# EAGLE design LatarTouch (EAGLE 9.6.2)
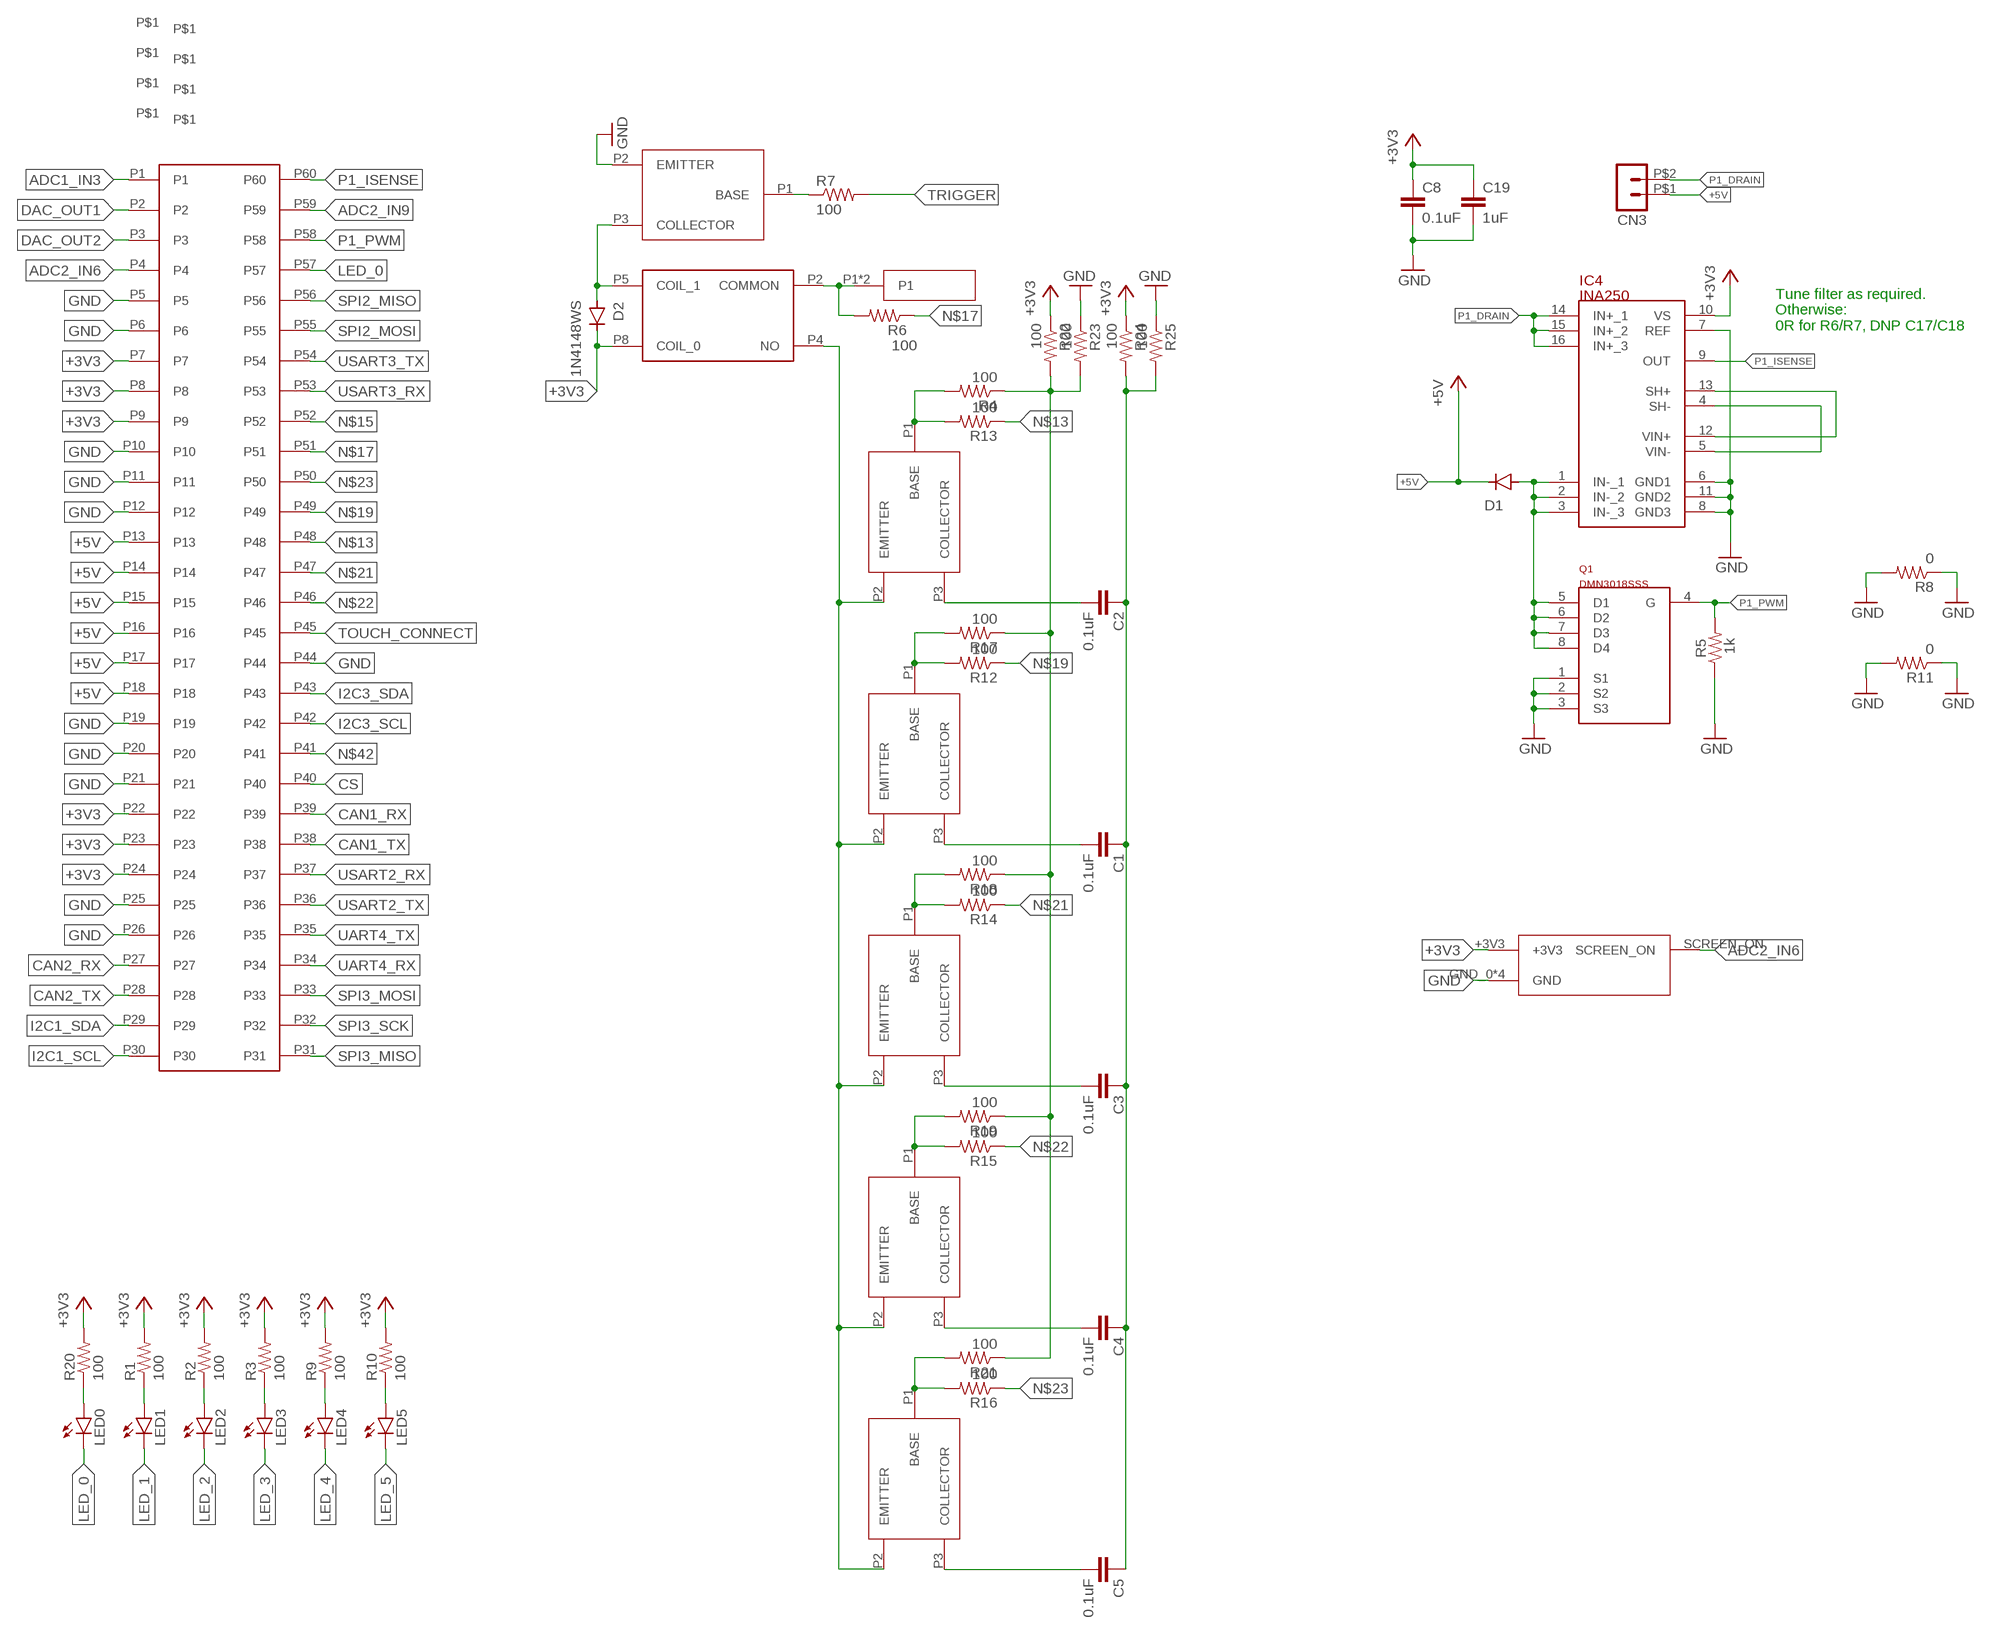
[diagram p0: schematic, sheet 1]

## Parts
C1  0.1uF  C-EUC0603  [C0603]
C2  0.1uF  C-EUC0603  [C0603]
C3  0.1uF  C-EUC0603  [C0603]
C4  0.1uF  C-EUC0603  [C0603]
C5  0.1uF  C-EUC0603  [C0603]
C8  0.1uF  C-EUC0805  [C0805]
C19  1uF  C-EUC0805  [C0805]
CN3  HEADER_POS2_43650-0212  [43650-0212]
D1  DIODE-DO214AC  [DO214AC]
D2  1N4148WS  [SOD-323]
IC4  INA250  [TSSOP16]
LED0  LEDCHIPLED_0603  [CHIPLED_0603]
LED1  LEDCHIPLED_0603  [CHIPLED_0603]
LED2  LEDCHIPLED_0603  [CHIPLED_0603]
LED3  LEDCHIPLED_0603  [CHIPLED_0603]
LED4  LEDCHIPLED_0603  [CHIPLED_0603]
LED5  LEDCHIPLED_0603  [CHIPLED_0603]
Q1  DMN3018SSS  [SO08]
R1  100  R-US_R0603  [R0603]
R2  100  R-US_R0603  [R0603]
R3  100  R-US_R0603  [R0603]
R4  100  R-US_R0603  [R0603]
R5  1k  RESISTOR0805  [0805]
R6  100  R-US_R0603  [R0603]
R7  100  R-US_R0603  [R0603]
R8  0  R-US_R0603  [R0603]
R9  100  R-US_R0603  [R0603]
R10  100  R-US_R0603  [R0603]
R11  0  R-US_R1206  [R1206]
R12  100  R-US_R0603  [R0603]
R13  100  R-US_R0603  [R0603]
R14  100  R-US_R0603  [R0603]
R15  100  R-US_R0603  [R0603]
R16  100  R-US_R0603  [R0603]
R17  100  R-US_R0603  [R0603]
R18  100  R-US_R0603  [R0603]
R19  100  R-US_R0603  [R0603]
R20  100  R-US_R0603  [R0603]
R21  100  R-US_R0603  [R0603]
R22  100  R-US_R0603  [R0603]
R23  100  R-US_R0603  [R0603]
R24  100  R-US_R0603  [R0603]
R25  100  R-US_R0603  [R0603]
U$4  TOUCH  TOUCH_PROBE  [TOUCH_PROBE]
U$5  MMBT3904  [SOT23]
U$6  DF12(3.0)-60DS-0.5V(86)  [DF12(3.0)-60DS-0.5V(86)]
U$7  9774030360R  [9774030360R]
U$8  DETECT_DAUGHTER_BOARD  [DETECT_DAUGHTER_BOARD]
U$9  9774030360R  [9774030360R]
U$10  9774030360R  [9774030360R]
U$11  9774030360R  [9774030360R]
U$14  G6L-1F  [G6L-1F]
U$15  MMBT3904  [SOT23]
U$16  MMBT3904  [SOT23]
U$17  MMBT3904  [SOT23]
U$18  MMBT3904  [SOT23]
U$19  MMBT3904  [SOT23]

## Nets
+3V3: C8.1 C19.1 IC4.10(VS) R1.2 R2.2 R3.2 R9.2 R10.2 R20.2 R22.1 R24.1 U$6.P7 U$6.P8 U$6.P9 U$6.P22 U$6.P23 U$6.P24 U$8.+3V3
+5V: CN3.P$1 D1.C U$6.P13 U$6.P14 U$6.P15 U$6.P16 U$6.P17 U$6.P18
ADC1_IN3: U$6.P1
ADC2_IN6: U$6.P4 U$8.SCREEN_ON
ADC2_IN9: U$6.P59
CAN1_RX: U$6.P39
CAN1_TX: U$6.P38
CAN2_RX: U$6.P27
CAN2_TX: U$6.P28
CS: U$6.P40
DAC_OUT1: U$6.P2
DAC_OUT2: U$6.P3
GND: C8.2 C19.2 IC4.6(GND1) IC4.7(REF) IC4.8(GND3) IC4.11(GND2) Q1.1(S1) Q1.2(S2) Q1.3(S3) R5.1 R8.1 R8.2 R11.1 R11.2 R23.1 R25.1 U$6.P5 U$6.P6 U$6.P10 U$6.P11 U$6.P12 U$6.P19 U$6.P20 U$6.P21 U$6.P25 U$6.P26 U$6.P44 U$8.GND_0(GND) U$8.GND_1(GND) U$8.GND_2(GND) U$8.GND_3(GND) U$15.P2(EMITTER)
I2C1_SCL: U$6.P30
I2C1_SDA: U$6.P29
I2C3_SCL: U$6.P42
I2C3_SDA: U$6.P43
LED_0: LED0.C U$6.P57
LED_1: LED1.C
LED_2: LED2.C
LED_3: LED3.C
LED_4: LED4.C
LED_5: LED5.C
N$1: R16.2 R21.2 U$19.P1(BASE)
N$2: LED1.A R1.1
N$3: R15.2 R19.2 U$18.P1(BASE)
N$4: R14.2 R18.2 U$17.P1(BASE)
N$5: R12.2 R17.2 U$16.P1(BASE)
N$6: R6.2 U$4.P1 U$4.P2(P1) U$14.P2(COMMON)
N$7: LED3.A R3.1
N$8: D1.A IC4.1(IN-_1) IC4.2(IN-_2) IC4.3(IN-_3) Q1.5(D1) Q1.6(D2) Q1.7(D3) Q1.8(D4)
N$9: IC4.4(SH-) IC4.5(VIN-)
N$10: R4.2 R13.2 U$5.P1(BASE)
N$11: IC4.12(VIN+) IC4.13(SH+)
N$12: LED2.A R2.1
N$13: R13.1 U$6.P48
N$14: U$5.P2(EMITTER) U$14.P4(NO) U$16.P2(EMITTER) U$17.P2(EMITTER) U$18.P2(EMITTER) U$19.P2(EMITTER)
N$15: U$6.P52
N$16: D2.A U$14.P5(COIL_1) U$15.P3(COLLECTOR)
N$17: R6.1 U$6.P51
N$18: D2.C U$14.P8(COIL_0)
N$19: R12.1 U$6.P49
N$21: R14.1 U$6.P47
N$22: R15.1 U$6.P46
N$23: R16.1 U$6.P50
N$24: R7.1 U$15.P1(BASE)
N$25: LED4.A R9.1
N$26: LED5.A R10.1
N$27: R4.1 R17.1 R18.1 R19.1 R21.1 R22.2 R23.2
N$34: C1.1 C2.1 C3.1 C4.1 C5.1 R24.2 R25.2
N$38: C5.2 U$19.P3(COLLECTOR)
N$39: C4.2 U$18.P3(COLLECTOR)
N$40: C3.2 U$17.P3(COLLECTOR)
N$41: C1.2 U$16.P3(COLLECTOR)
N$42: U$6.P41
N$43: C2.2 U$5.P3(COLLECTOR)
N$48: LED0.A R20.1
P1_DRAIN: CN3.P$2 IC4.14(IN+_1) IC4.15(IN+_2) IC4.16(IN+_3)
P1_ISENSE: IC4.9(OUT) U$6.P60
P1_PWM: Q1.4(G) R5.2 U$6.P58
SPI2_MISO: U$6.P56
SPI2_MOSI: U$6.P55
SPI3_MISO: U$6.P31
SPI3_MOSI: U$6.P33
SPI3_SCK: U$6.P32
TOUCH_CONNECT: U$6.P45
TRIGGER: R7.2
UART4_RX: U$6.P34
UART4_TX: U$6.P35
USART2_RX: U$6.P37
USART2_TX: U$6.P36
USART3_RX: U$6.P53
USART3_TX: U$6.P54
Unconnected: U$7.P$1 U$9.P$1 U$10.P$1 U$11.P$1

## Notes on the sheet
- Tune filter as required. 
  Otherwise:
  0R for R6/R7, DNP C17/C18

## Library data of the parts
C1-C5 C8 C19 = rcl:C-EU: CAPACITOR, European symbol; SPICEPREFIX: C
CN3 = con-molex-micro-fit-3_0:HEADER_POS2_?: Molex - Micro-Fit 3.0 Series connector, 3.00mm (0.118") pitch header, 2 positions.
D1 = diode:DIODE-: DIODE
D2 = Diodes:1N4148WS: DIODE GEN PURP 75V 150MA SOD323F Manufacturer's datasheet <https://www.onsemi.com/pub/Collateral/1N914BWS-D.pdf>; CREATED_BY: PCBLayout.com; DIGIKEY_PART_NUMBER: 1N4148WSFSTR-ND; MANUFACTURER: Diodes Incorporated; MPN: 1N4148WS; PACKAGE: SOD-323
IC4 = HappyMedium:INA250
LED0 LED1-LED5 = led:LED: LED OSRAM: - CHIPLED LG R971, LG N971, LY N971, LG Q971, LY Q971, LO R971, LY R971 LH N974, LH R974 LS Q976, LO Q976, LY Q976 LO Q996 - Hyper CHIPLED LW Q18S LB Q993, LB Q99A, LB R99A - SideLED LS A670, LO A670, LY A670, LG A670, LP A670 LB A673, LV A673, LT A673, LW A673 LH A674 LY A675 LS A676, LA A676, LO A676, LY A676, LW A676 LS A679, LY A679, LG A679 - Hyper Micro SIDELED® LS Y876, LA Y876, LO Y876, LY Y876 LT Y87S - SmartLED LW L88C, LW L88S LB L89C, LB L89S, LG L890 LS L89K, LO L89K, LY L89K LS L896, LA L896, LO L896, LY L896 - TOPLED LS T670, LO T670, LY T670, LG T670, LP T670 LSG T670, LSP T670, LSY T670, LOP T670, LYG T670 LG T671, LOG T671, LSG T671 LB T673, LV T673, LT T673, LW T673 LH T674 LS T676, LA T676, LO T676, LY T676, LB T676, LH T676, LSB T676, LW T676 LB T67C, LV T67C, LT T67C, LS T67K, LO T67K, LY T67K, LW E67C LS E67B, LA E67B, LO E67B, LY E67B, LB E67C, LV E67C, LT E67C LW T67C LS T679, LY T679, LG T679 LS T770, LO T770, LY T770, LG T770, LP T770 LB T773, LV T773, LT T773, LW T773 LH T774 LS E675, LA E675, LY E675, LS T675 LS T776, LA T776, LO T776, LY T776, LB T776 LHGB T686 LT T68C, LB T68C - Hyper Mini TOPLED® LB M676 - Mini TOPLED Santana® LG M470 LS M47K, LO M47K, LY M47K Source: http://www.osram.convergy.de LUXEON: - LUMILED® LXK2-PW12-R00, LXK2-PW12-S00, LXK2-PW14-U00, LXK2-PW14-V00 LXK2-PM12-R00, LXK2-PM12-S00, LXK2-PM14-U00 LXK2-PE12-Q00, LXK2-PE12-R00, LXK2-PE12-S00, LXK2-PE14-T00, LXK2-PE14-U00 LXK2-PB12-K00, LXK2-PB12-L00, LXK2-PB12-M00, LXK2-PB14-N00, LXK2-PB14-P00, LXK2-PB14-Q00 LXK2-PR12-L00, LXK2-PR12-M00, LXK2-PR14-Q00, LXK2-PR14-R00 LXK2-PD12-Q00, LXK2-PD12-R00, LXK2-PD12-S00 LXK2-PH12-R00, LXK2-PH12-S00 LXK2-PL12-P00, LXK2-PL12-Q00, LXK2-PL12-R00 Source: www.luxeon.com KINGBRIGHT: KA-3528ASYC Source: www.kingbright.com
Q1 = HappyMedium:DMN3018SSS
R1-R3 R6-R10 R20 = rcl:R-US_: RESISTOR, American symbol; SPICEPREFIX: R
R4 R11-R19 R21-R25 = resistor:R-US_: RESISTOR, American symbol
R5 = SparkFun-Resistors:RESISTOR: Generic Resistor Package
U$4 = psemi:TOUCH_PROBE
U$5 U$15-U$19 = psemi:MMBT3904
U$6 = poe:DF12(3.0)-60DS-0.5V(86)
U$7 U$9-U$11 = poe:9774030360R
U$8 = psemi:DETECT_DAUGHTER_BOARD
U$14 = psemi:G6L-1F

## Board
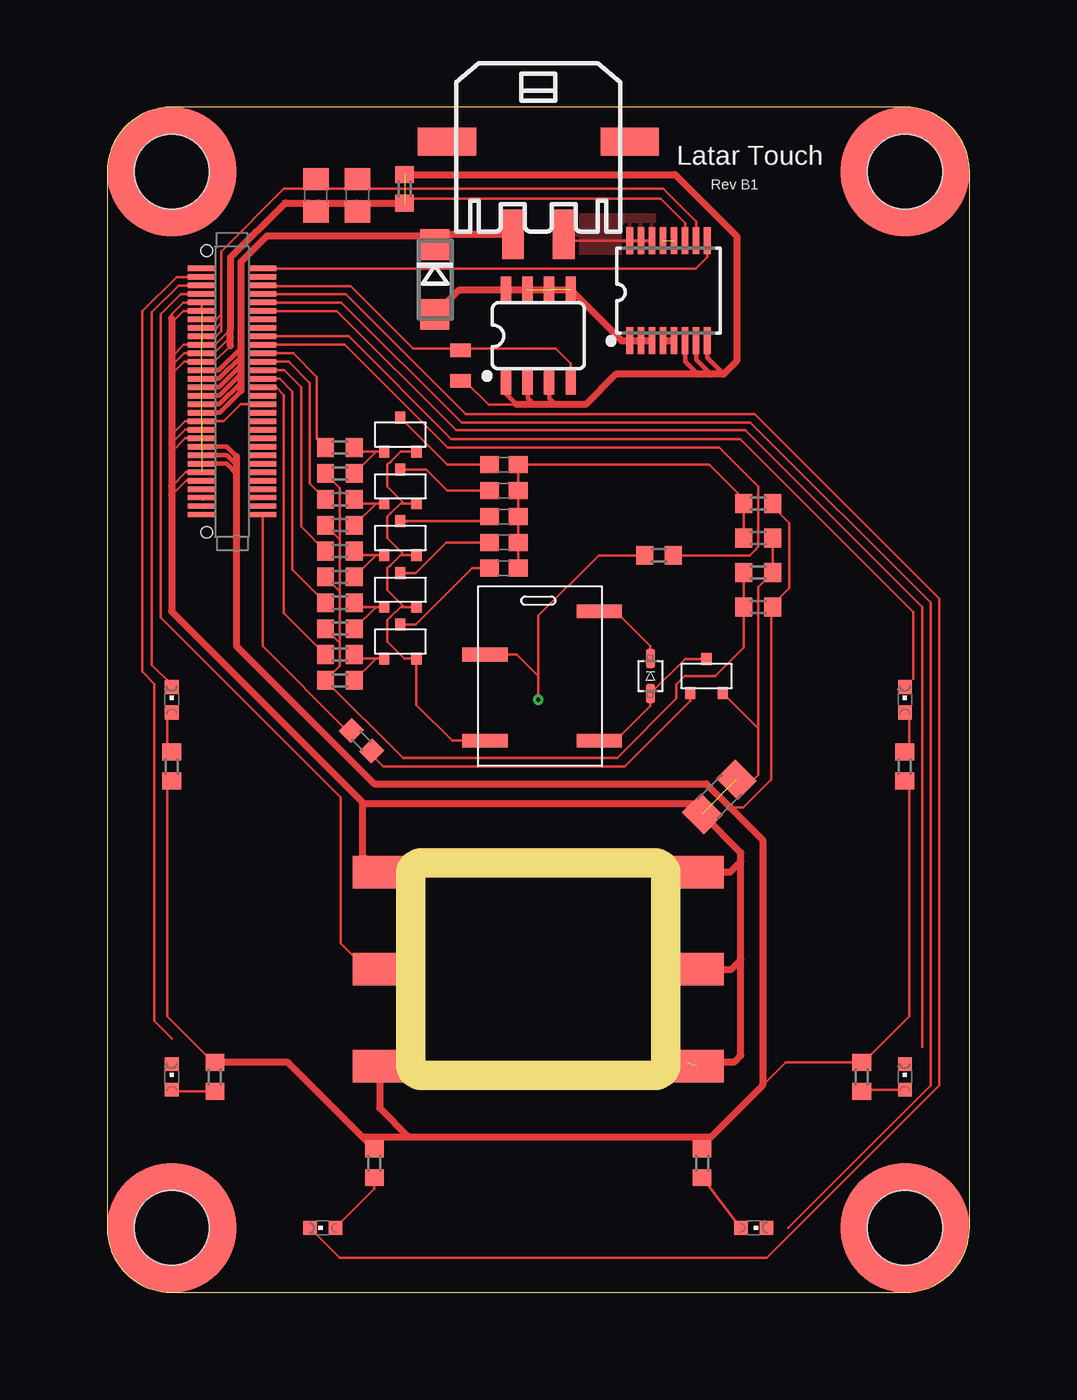
[diagram p1: board, top side]
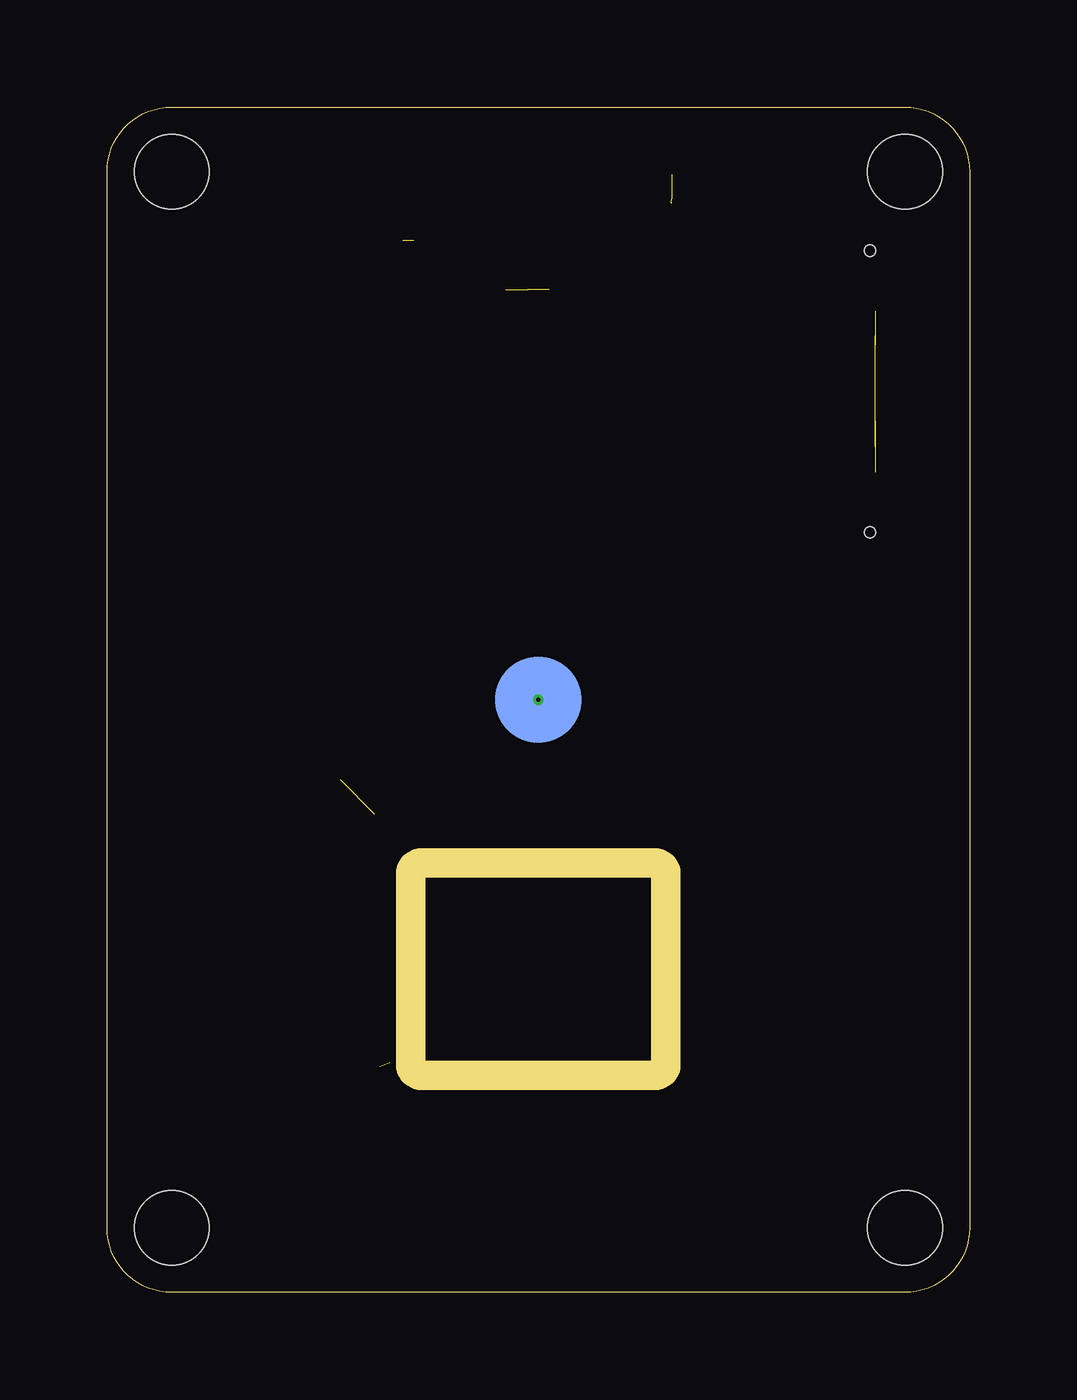
[diagram p2: board, bottom side, seen from below]

Size 50.8 x 69.85 mm. Coordinates in mm from the lower left corner, seen from the top.
Outline: 0,66.04 0,3.81 arc90 3.81,0 46.99,0 arc90 50.8,3.81 50.8,66.04 arc90 46.99,69.85 3.81,69.85 arc90 0,66.04
Copper layers (1*16): Top 0.0356mm / dielectric 1.5011mm / Bottom 0.0356mm
Design rules "LaenPCBOrder": minimum track width 6mil, minimum drill 13mil, track to track 6mil, track to pad 6mil, pad to pad 6mil, via to via 6mil, smd to smd 6mil, copper to edge 15mil, drill to drill 6mil, minimum pad ring 7mil, minimum via ring 7mil, stop-mask expansion 3mil, vias tented up to drill 0mil, thermal gap 10mil

### Footprints (pad centres in the part's own frame; a part is rotated, then mirrored left to right if it is on the bottom)
C0603 = smd 1.1 x 1: 1 -0.85,0; 2 0.85,0
C0805 = smd 1.3 x 1.5: 1 -0.95,0; 2 0.95,0
43650-0212 = smd 1.27 x 2.92: P$1 1.5,5.48; P$2 -1.5,5.48 | smd 3.43 x 1.65: TAB1 5.38,0; TAB2 -5.38,0
DO214AC = smd 1.8 x 1.7: A 2.05,0; C -2.05,0
SOD-323 = smd 1.14 x 0.52: A 1.04,0; C -1.04,0
TSSOP16 = smd 0.4 x 1.6: 1 -2.225,-2.85; 2 -1.575,-2.85; 3 -0.925,-2.85; 4 -0.275,-2.85; 5 0.375,-2.85; 6 1.025,-2.85; 7 1.675,-2.85; 8 2.325,-2.85; 9 2.325,3.05; 10 1.675,3.05; 11 1.025,3.05; 12 0.375,3.05; 13 -0.275,3.05; 14 -0.925,3.05; 15 -1.575,3.05; 16 -2.225,3.05
CHIPLED_0603 = smd 0.8 x 0.8: A 0,-0.75; C 0,0.75
SO08 = smd 0.6 x 1.55: 1 -1.905,-2.7; 2 -0.635,-2.7; 3 0.635,-2.7; 4 1.905,-2.7; 5 1.905,2.7; 6 0.635,2.7; 7 -0.635,2.7; 8 -1.905,2.7
R0603 = smd 1 x 1.1: 1 -0.85,0; 2 0.85,0
0805 = smd 0.8 x 1.2: 1 -0.9,0; 2 0.9,0
R1206 = smd 1.6 x 1.803: 1 -1.422,0; 2 1.422,0
TOUCH_PROBE = smd 5.08 x 5.08: P1 0,0 | drill 0.254: P2 0,0
SOT23 = smd 0.6 x 0.7: P1 -0.95,-1; P2 0.95,-1; P3 0,1
DF12(3.0)-60DS-0.5V(86) = smd 0.32 x 1.62: P1 7.25,1.8; P2 6.75,1.8; P3 6.25,1.8; P4 5.75,1.8; P5 5.25,1.8; P6 4.75,1.8; P7 4.25,1.8; P8 3.75,1.8; P9 3.25,1.8; P10 2.75,1.8; P11 2.25,1.8; P12 1.75,1.8; P13 1.25,1.8; P14 0.75,1.8; P15 0.25,1.8; P16 -0.25,1.8; P17 -0.75,1.8; P18 -1.25,1.8; P19 -1.75,1.8; P20 -2.25,1.8; P21 -2.75,1.8; P22 -3.25,1.8; P23 -3.75,1.8; P24 -4.25,1.8; P25 -4.75,1.8; P26 -5.25,1.8; P27 -5.75,1.8; P28 -6.25,1.8; P29 -6.75,1.8; P30 -7.25,1.8; P31 -7.25,-1.8; P32 -6.75,-1.8; P33 -6.25,-1.8; P34 -5.75,-1.8; P35 -5.25,-1.8; P36 -4.75,-1.8; P37 -4.25,-1.8; P38 -3.75,-1.8; P39 -3.25,-1.8; P40 -2.75,-1.8; P41 -2.25,-1.8; P42 -1.75,-1.8; P43 -1.25,-1.8; P44 -0.75,-1.8; P45 -0.25,-1.8; P46 0.25,-1.8; P47 0.75,-1.8; P48 1.25,-1.8; P49 1.75,-1.8; P50 2.25,-1.8; P51 2.75,-1.8; P52 3.25,-1.8; P53 3.75,-1.8; P54 4.25,-1.8; P55 4.75,-1.8; P56 5.25,-1.8; P57 5.75,-1.8; P58 6.25,-1.8; P59 6.75,-1.8; P60 7.25,-1.8 | hole 0.65: -8.3,1.5; 8.3,1.5
9774030360R = smd 7.62 x 7.62: P$1 0,0 | hole 4.4: 0,0
DETECT_DAUGHTER_BOARD = smd 3.175 x 1.905: +3V3 -9.347,-5.715; GND_0 -9.347,5.715; GND_1 9.347,-5.715; GND_2 9.347,0; GND_3 9.347,5.715; SCREEN_ON -9.347,0
G6L-1F = smd 0.8 x 2.66: P2 -1.27,-3.14; P4 3.81,-3.14; P5 3.81,3.6; P8 -3.81,3.6

### Placement (x,y rotation side)
C1  23.37,47.24 180 top
C2  23.37,45.72 180 top
C3  23.37,44.2 180 top
C4  23.37,42.67 180 top
C5  23.37,48.77 180 top
C8  12.29,64.64 270 top
C19  14.76,64.64 270 top
CN3  25.4,67.82 180 top
D1  19.3,59.69 270 top
D2  32,36.32 270 top
IC4  33.02,58.93 0 top
LED0  12.7,3.81 90 top
LED1  38.1,3.81 270 top
LED2  3.81,34.92 0 top
LED3  46.99,34.92 0 top
LED4  3.81,12.7 0 top
LED5  46.99,12.7 0 top
Q1  25.4,56.39 0 top
R1  35.05,7.62 90 top
R2  3.81,30.99 270 top
R3  46.99,30.99 270 top
R4  13.72,42.16 0 top
R5  20.83,54.61 90 top
R6  32.51,43.43 180 top
R7  14.99,32.51 135 top
R8  17.53,65.02 90 top
R9  6.35,12.7 90 top
R10  44.45,12.7 90 top
R11  36.07,29.21 45 top
R12  13.72,46.74 0 top
R13  13.72,43.69 0 top
R14  13.72,40.64 0 top
R15  13.72,37.59 0 top
R16  13.72,49.78 0 top
R17  13.72,45.21 0 top
R18  13.72,39.12 0 top
R19  13.72,36.07 0 top
R20  15.75,7.62 90 top
R21  13.72,48.26 0 top
R22  38.35,40.39 180 top
R23  38.35,42.42 180 top
R24  38.35,46.48 180 top
R25  38.35,44.45 180 top
U$4  25.4,34.92 0 bottom
U$5  17.27,44.45 0 top
U$6  7.37,53.09 90 top
U$7  3.81,66.04 0 top
U$8  25.4,19.05 0 top
U$9  3.81,3.81 0 top
U$10  46.99,3.81 0 top
U$11  46.99,66.04 0 top
U$14  25.4,36.32 270 top
U$15  35.31,36.32 0 top
U$16  17.27,47.5 0 top
U$17  17.27,41.4 0 top
U$18  17.27,38.35 0 top
U$19  17.27,50.55 0 top

### Tracks (layer width: path | path; a pad name or v marks a point on that pad's centre or on a via)
+3V3  (1 unrouted)
  Top 0.152: IC4.10 34.7,63.09 32.77,65.02 14.95,65.02 | U$6.P8 5.59,56.84 | 5.59,56.84 6.42,56.84 6.73,57.15 | 6.73,57.63 6.73,61.34 10.41,65.02 11.72,65.02 | 11.72,65.02 14.95,65.02 | 5.57,56.81 5.59,56.84 | R2.2 3.56,29.88 3.56,16.26 6.31,13.51 10.71,13.51 | U$6.P9 6.43,56.34 6.73,56.64 6.73,57.15 | 6.73,57.15 6.73,57.63 | U$6.P7 6.43,57.34 6.73,57.63 | C8.1 11.72,65.02 | 14.95,65.02 14.76,65.22 C19.1 | 20.07,9.14 18.8,9.14 | 38.1,11.68 39.97,13.55 R10.2 44.54,13.55 47.24,16.26 47.24,29.88 R3.2 | 36.7,28.57 37.47,28.57 39.12,30.23 39.12,40.3 R22.1 39.2,40.54 40.19,41.52 40.19,45.35 39.2,46.33 R24.1 | R1.2 35.05,9.14
  Top 0.254: U$6.P22 7.06,49.84 7.62,49.28 | U$6.P23 7.05,49.34 7.62,48.77 | U$6.P24 7.04,48.84 7.62,48.26
  Top 0.406: 7.62,49.28 7.62,48.77 7.62,48.26 7.62,38.1 15.75,29.97 35.31,29.97 36.7,28.57 38.61,26.67 38.61,12.19 38.1,11.68 35.56,9.14 35.05,9.14 18.8,9.14 17.78,9.14 | R20.2 15.07,9.14 | 15.07,9.14 10.71,13.51 10.67,13.55 R9.2 | U$8.+3V3 16.05,10.87 17.78,9.14 | 17.78,9.14 15.07,9.14
+5V
  Top 0.254: U$6.P18 6.62,51.84 7.9,53.11 | U$6.P17 6.62,52.34 7.9,53.62 | U$6.P16 6.61,52.84 7.9,54.13 | U$6.P15 6.6,53.34 7.9,54.63 | U$6.P14 6.59,53.84 7.9,55.14 | U$6.P13 6.58,54.34 7.9,55.65
  Top 0.406: 7.9,53.11 7.9,53.62 7.9,54.13 7.9,54.63 7.9,55.14 7.9,55.65 7.9,60.73 9.42,62.25 18.8,62.25 D1.C 19.9,62.34 CN3.P$1 23.82,62.41
ADC1_IN3
  Top 0.152: U$6.P1 5.56,60.33
ADC2_IN6
  Top 0.152: U$6.P4 4.35,58.84 3.17,57.66 3.17,39.76 13.77,29.16 13.77,20.57 15.29,19.05 U$8.SCREEN_ON
CAN2_RX
  Top 0.152: U$6.P27 5.68,47.23
CAN2_TX
  Top 0.152: U$6.P28 5.68,46.73
DAC_OUT1
  Top 0.152: U$6.P2 4.11,59.84 2.08,57.81 2.08,36.58 2.79,35.87 2.79,16 3.81,14.99
DAC_OUT2
  Top 0.152: U$6.P3 4.22,59.34 2.64,57.76 2.64,36.98 3.81,35.81
GND  (10 unrouted)
  Top 0.152: 7.26,56.74 6.36,55.84 U$6.P10 4.53,55.84 3.81,55.12 3.81,54.61 | 10.49,64.19 10.53,64.19 | 17.54,64.44 32.61,64.44 34.05,63.01 IC4.11 | 23.47,53.71 Q1.1 | 3.81,50.55 4.6,51.34 U$6.P19 6.89,51.34 7.89,52.34 U$6.P44 | U$6.P20 4.61,50.84 3.81,50.04 | U$6.P21 4.62,50.34 3.81,49.53 | U$6.P25 4.65,48.34 3.81,47.5 | U$6.P26 4.66,47.84 3.81,46.99 | 3.81,54.61 3.81,54.1 4.54,54.84 U$6.P12 6.33,54.84 7.26,55.77 | 3.81,54.61 4.54,55.34 U$6.P11 6.31,55.34 7.26,56.29 | 11.8,64.19 C8.2 12.29,64.03 12.45,64.19 | 24.13,52.32 22.47,52.32 21.08,53.71 R5.1 | R11.2 38.09,30.22 38.35,30.48 38.35,33.22 | R11.1 34.47,28.79 34.45,28.79 | U$15.P2 38.35,33.22 | 38.35,33.22 38.35,41.57 R23.1 R25.1 | C19.2 14.76,64.16 14.73,64.19 | U$6.P5 U$6.P6 4.5,57.84 3.81,57.15 3.81,57.4 3.81,57.66 4.49,58.34 U$6.P5
  Top 0.254: 34.04,56.07 IC4.6 34.05,54.85 34.8,54.1 | Q1.1 23.37,53.56 23.37,53.09 24.13,52.32 25.15,52.32 | 28.19,52.32 26.42,52.32 | 26.42,52.32 25.15,52.32 | Q1.2 24.77,52.7 25.15,52.32 | Q1.3 26.04,52.7 26.42,52.32 | IC4.7 34.7,54.97 35.56,54.1 | IC4.8 35.34,55.08 36.32,54.1
  Top 0.406: 10.53,64.19 11.8,64.19 12.45,64.19 14.73,64.19 17.57,64.19 | 10.49,64.19 7.26,60.96 7.26,56.74 7.26,56.29 7.26,55.77 | U$8.GND_0 15.04,25.78 15.04,28.79 15.15,28.79 | 34.45,28.79 15.15,28.79 | U$8.GND_3 36.7,24.77 37.34,25.4 | 37.34,19.61 37.34,13.97 36.93,13.56 34.16,13.56 | U$8.GND_2 36.78,19.05 37.34,19.61 | 37.34,19.61 37.34,25.4 | 37.34,25.4 37.34,25.91 R11.1 | 15.15,28.79 3.81,40.13 3.81,46.99 3.81,47.5 3.81,57.4 | 24.13,52.32 28.19,52.32 29.97,54.1 34.8,54.1 35.56,54.1 36.32,54.1 37.08,54.86 37.08,62.25 33.46,65.87 R8.2
I2C1_SCL
  Top 0.152: U$6.P30 6.23,45.84
I2C1_SDA
  Top 0.152: U$6.P29 5.68,46.23
LED_0
  Top 0.152: U$6.P57 14.06,58.84 21.13,51.77 38.15,51.77 49.02,40.89 49.02,12.19 38.86,2.03 13.72,2.03 11.95,3.8 LED0.C
N$1
  Top 0.152: R16.2 14.8,49.55 U$19.P1 15.85,49.55 R21.2
N$2
  Top 0.152: LED1.A 37.25,3.91 R1.1
N$3
  Top 0.152: R15.2 14.8,37.35 U$18.P1 15.85,37.35 R19.2
N$4
  Top 0.152: R14.2 14.8,40.4 U$17.P1 15.85,40.4 R18.2
N$5
  Top 0.152: R12.2 14.8,46.5 U$16.P1 15.85,46.5 R17.2
N$6
  Top 0.152: U$4.P1 25.4,36.32 | 25.4,36.32 25.4,39.88 28.96,43.43 R6.2 | U$14.P2 24.13,37.59 25.4,36.32
N$7
  Top 0.152: LED3.A 47.24,33.92 47.24,32.09 R3.1
N$8  (2 unrouted)
  Top 0.406: IC4.3 IC4.2 IC4.1 30.32,56.08 Q1.5 Q1.8 20.75,59.09 D1.A
N$9
  Top 0.406: IC4.4 IC4.5
N$10
  Top 0.152: R13.2 14.8,43.45 U$5.P1 15.85,43.45 R4.2
N$11  (1 unrouted)
N$12
  Top 0.152: LED2.A 3.56,33.92 3.56,32.09 R2.1
N$13
  Top 0.152: U$6.P48 10.43,54.34 11.43,53.34 11.43,45.12 R13.1
N$14
  Top 0.152: U$18.P2 18.22,34.61 20.32,32.51 U$14.P4 | U$18.P2 18.21,37.34 18.03,37.34 | U$18.P2 17.51,37.35 16.51,38.35 16.51,39.62 16.71,39.82 16.72,39.82 17.3,40.4 U$17.P2 17.51,40.4 16.51,41.4 16.51,42.67 16.71,42.87 16.72,42.87 17.3,43.45 U$5.P2 17.51,43.45 16.51,44.45 16.51,45.72 16.71,45.92 16.72,45.92 17.3,46.5 U$16.P2 17.51,46.5 16.51,47.5 16.51,48.77 16.71,48.97 16.72,48.97 17.3,49.55 U$19.P2
N$15
  Top 0.152: U$6.P52 14.22,56.34 20.27,50.29 37.29,50.29 47.47,40.11 47.47,36.16
N$16
  Top 0.152: U$14.P5 29.97,32.51 32,34.54 D2.A 34.04,37.32 U$15.P3
N$17
  Top 0.152: R6.1 37.86,43.43 38.23,43.8 38.23,43.82 38.35,43.94 38.35,47.5 36.07,49.78 20.07,49.78 14.01,55.84 U$6.P51
N$18
  Top 0.152: D2.C 32,38.1 29.97,40.13 U$14.P8
N$19
  Top 0.152: R12.1 11.94,47.66 11.94,53.59 10.7,54.84 U$6.P49
N$21
  Top 0.152: R14.1 10.92,42.58 10.92,53.09 10.17,53.84 U$6.P47
N$22
  Top 0.152: R15.1 10.41,40.04 10.41,52.88 9.96,53.34 U$6.P46
N$23
  Top 0.152: 9.18,55.32 U$6.P50 10.96,55.34 12.36,53.94 12.36,50.29 R16.1
N$24
  Top 0.152: R7.1 15.59,31.66 16.26,30.99 30.48,30.99 34.36,34.86 U$15.P1
N$25
  Top 0.152: R9.1 3.91,11.85 LED4.A
N$26
  Top 0.152: LED5.A 44.55,11.95 R10.1
N$27
  Top 0.152: 13.72,38.27 R18.1 | 13.72,38.27 13.72,36.92 R19.1 17.44,31.5 30.04,31.5 33.53,34.99 33.53,35.81 34.04,36.32 35.81,36.32 37.5,38.01 R22.2 R23.2 | 13.72,38.27 13.72,41.31 | 13.72,41.31 13.72,44.36 | 13.72,44.36 13.72,47.41 R21.1 | R17.1 13.72,44.36 | R4.1 13.72,41.31
N$34
  Top 0.152: R25.2 R24.2 37.5,46.74 35.47,48.77 C5.1 C1.1 C2.1 C3.1 C4.1
N$38
  Top 0.152: U$19.P3 20.05,48.77 C5.2
N$39
  Top 0.152: U$18.P3 18.18,39.35 21.5,42.67 C4.2
N$40
  Top 0.152: U$17.P3 18.18,42.4 19.98,44.2 C3.2
N$41
  Top 0.152: U$16.P3 18.8,48.5 20.05,47.24 C1.2
N$43
  Top 0.152: U$5.P3 17.29,45.47 22.26,45.47 C2.2
N$48
  Top 0.152: LED0.A 15.75,6.11 R20.1
P1_DRAIN
  Top 0.152: CN3.P$2 27.26,61.98 IC4.16 IC4.15 IC4.14
  pour Top (isolate 0.254): 26.42,61.21 26.42,63.5 32.26,63.5 32.26,61.21
P1_ISENSE
  Top 0.152: 35.34,62.02 IC4.9 35.34,61 34.68,60.34 U$6.P60 9.18,60.33
P1_PWM
  Top 0.152: U$6.P58 9.19,59.31 14.35,59.31 18.03,55.63 21.08,55.63 26.42,55.63 27.3,54.74 Q1.4
  Top 0.406: R5.2 20.94,55.63 21.08,55.63
SPI2_MISO
  Top 0.152: U$6.P56 13.8,58.34 20.88,51.26 37.9,51.26 48.51,40.64 48.51,12.19 40.13,3.81
SPI2_MOSI
  Top 0.152: U$6.P55 13.54,57.84 20.57,50.8 37.59,50.8 48.01,40.39 48.01,14.47
SPI3_MISO
  Top 0.152: U$6.P31 9.17,38.08 14.13,33.11
SPI3_MOSI
  Top 0.152: U$6.P33

### Text on the board
tPlace: Latar Touch | Rev B1